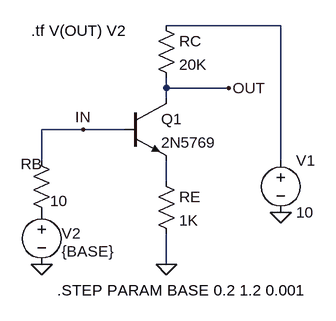
[diagram p0: schematic Fig_6-20_1_Tr_Amp_TF_step-RB1.asc]
Fig_6-20_1_Tr_Amp_TF_step-RB1.asc, the LTspice schematic file:
Version 4
SHEET 1 880 680
WIRE 304 64 128 64
WIRE 128 160 128 144
WIRE 224 160 128 160
WIRE 128 176 128 160
WIRE 0 224 -64 224
WIRE 64 224 0 224
WIRE -64 272 -64 224
WIRE 304 272 304 64
WIRE 128 304 128 272
WIRE 128 432 128 384
FLAG 128 432 0
FLAG -64 432 0
FLAG 304 352 0
FLAG 224 160 OUT
FLAG 0 224 IN
SYMBOL npn 64 176 R0
SYMATTR InstName Q1
SYMATTR Value 2N5769
SYMBOL res 112 48 R0
SYMATTR InstName RC
SYMATTR Value 20K
SYMBOL res 112 288 R0
SYMATTR InstName RE
SYMATTR Value 1K
SYMBOL voltage 304 256 R0
WINDOW 123 0 0 Left 2
WINDOW 39 0 0 Left 2
SYMATTR InstName V1
SYMATTR Value 10
SYMBOL voltage -64 336 R0
WINDOW 123 25 102 Left 2
WINDOW 39 0 0 Left 2
WINDOW 0 31 48 Left 2
WINDOW 3 31 76 Left 2
SYMATTR InstName V2
SYMATTR Value {BASE}
SYMBOL res -80 256 R0
WINDOW 0 -16 21 Left 2
WINDOW 3 29 78 Left 2
SYMATTR InstName RB
SYMATTR Value 10
TEXT -80 72 Left 2 !.tf V(OUT) V2
TEXT -40 472 Left 2 !.STEP PARAM BASE 0.2 1.2 0.001

The netlist it stands for:
* Fig_6-20_1_Tr_Amp_TF_step-RB1.asc
Q1 OUT IN N002 0 2N5769
RC N001 OUT 20K
RE N002 0 1K
V1 N001 0 10
V2 P001 0 {BASE}
RB IN P001 10
.model NPN NPN
.model PNP PNP
.lib standard.bjt
.tf V(OUT) V2
.STEP PARAM BASE 0.2 1.2 0.001
.backanno
.end